# Altium schematic sheet SmartGarden_PCB.SchDoc
size A4; SheetNumber: 1; SheetTotal: 1
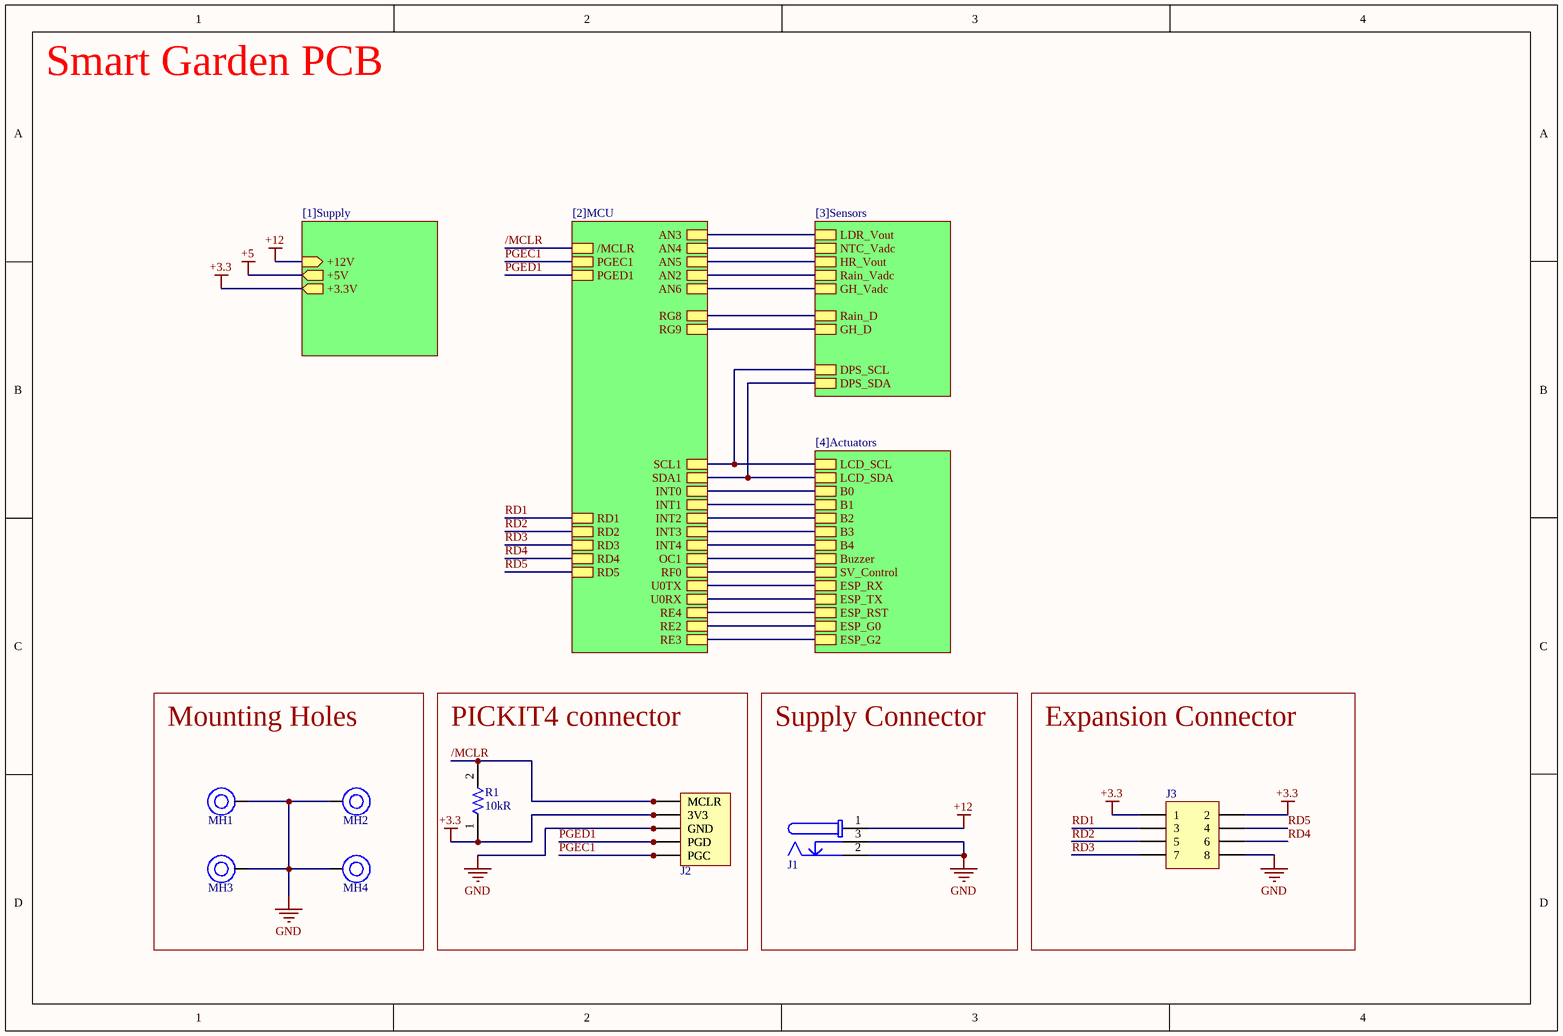
[diagram p0: SmartGarden_PCB.SchDoc]

## Parts
J1  694108301002  [694108301002]  (value not drawn)
J2  61300511121  [J_PinHeader_1x5]  (value not drawn)
J3  J_DualSocketHeader_8  [Dual socket header 8 pins]  (value not drawn)
MH1  Mounting_Hole_M3  [Mounting_Hole_M3]  (value not drawn)
MH2  Mounting_Hole_M3  [Mounting_Hole_M3]  (value not drawn)
MH3  Mounting_Hole_M3  [Mounting_Hole_M3]  (value not drawn)
MH4  Mounting_Hole_M3  [Mounting_Hole_M3]  (value not drawn)
R1  Resistance: 10kR  [R0805FTK]  (hidden comment: CR0805-JW-103ELF)

## Blocks framed on the sheet
Mounting Holes: MH1-MH4
PICKIT4 connector: J2 R1
Supply Connector: J1
Expansion Connector: J3

## Sub-sheets
[1]Supply = [1]Supply: +12V (in), +5V (out), +3.3V (out)
[2]MCU = [2]MCU: /MCLR, PGEC1, PGED1, SCL1, SDA1, OC1, RF0, INT0, INT3, INT4, INT2, INT1, AN3, AN4, AN5, AN2, AN6, U0RX, U0TX, RE2, RE3, RE4, RG8, RG9, RD2, RD3, RD4, RD5, RD1
[3]Sensors = [3]Sensors: LDR_Vout, DPS_SDA, DPS_SCL, NTC_Vadc, HR_Vout, Rain_Vadc, GH_Vadc, Rain_D, GH_D
[4]Actuators = [4]Actuators: LCD_SDA, LCD_SCL, Buzzer, SV_Control, B0, B1, B2, B3, B4, ESP_TX, ESP_G2, ESP_G0, ESP_RST, ESP_RX

## Nets
+3.3: J2.2(3V3) J3.1 J3.2 R1.1 ; sheet [1]Supply/+3.3V
+5: sheet [1]Supply/+5V
+12: J1.1 ; sheet [1]Supply/+12V
GND: J1.2 J1.3 J2.3(GND) J3.8 MH1.1 MH2.1 MH3.1 MH4.1
/MCLR: J2.1(MCLR) R1.2 ; sheet [2]MCU//MCLR
PGEC1: J2.5(PGC) ; sheet [2]MCU/PGEC1
PGED1: J2.4(PGD) ; sheet [2]MCU/PGED1
RD1: J3.3 ; sheet [2]MCU/RD1
RD2: J3.5 ; sheet [2]MCU/RD2
RD3: J3.7 ; sheet [2]MCU/RD3
RD4: J3.6 ; sheet [2]MCU/RD4
RD5: J3.4 ; sheet [2]MCU/RD5
(unnamed): sheet [2]MCU/SCL1, sheet [3]Sensors/DPS_SCL, sheet [4]Actuators/LCD_SCL
(unnamed): sheet [2]MCU/SDA1, sheet [3]Sensors/DPS_SDA, sheet [4]Actuators/LCD_SDA
(unnamed): sheet [2]MCU/OC1, sheet [4]Actuators/Buzzer
(unnamed): sheet [2]MCU/RF0, sheet [4]Actuators/SV_Control
(unnamed): sheet [2]MCU/INT0, sheet [4]Actuators/B0
(unnamed): sheet [2]MCU/INT3, sheet [4]Actuators/B3
(unnamed): sheet [2]MCU/INT4, sheet [4]Actuators/B4
(unnamed): sheet [2]MCU/INT2, sheet [4]Actuators/B2
(unnamed): sheet [2]MCU/INT1, sheet [4]Actuators/B1
(unnamed): sheet [2]MCU/AN3, sheet [3]Sensors/LDR_Vout
(unnamed): sheet [2]MCU/AN4, sheet [3]Sensors/NTC_Vadc
(unnamed): sheet [2]MCU/AN5, sheet [3]Sensors/HR_Vout
(unnamed): sheet [2]MCU/AN2, sheet [3]Sensors/Rain_Vadc
(unnamed): sheet [2]MCU/AN6, sheet [3]Sensors/GH_Vadc
(unnamed): sheet [2]MCU/U0RX, sheet [4]Actuators/ESP_TX
(unnamed): sheet [2]MCU/U0TX, sheet [4]Actuators/ESP_RX
(unnamed): sheet [2]MCU/RE2, sheet [4]Actuators/ESP_G0
(unnamed): sheet [2]MCU/RE3, sheet [4]Actuators/ESP_G2
(unnamed): sheet [2]MCU/RE4, sheet [4]Actuators/ESP_RST
(unnamed): sheet [2]MCU/RG8, sheet [3]Sensors/Rain_D
(unnamed): sheet [2]MCU/RG9, sheet [3]Sensors/GH_D

## Notes on the sheet
- Smart Garden PCB

## Library data of the parts
J1 = 694108301002: WR-DC DC Power Jack Connector, Male, Right Angled, 24V, 5A; Manufacturer: Wurth Elektronik; Opening Diameter: 6.4mm; Plug Inner Diameter: 2.55mm; Plug Outer Diameter: 5.5mm; ComponentLink1Description: Website Link; ComponentLink1URL: https://www.we-online.com/redexpert/article/694108301002?ad; ComponentLink2Description: Datasheet Link; ComponentLink2URL: https://www.we-online.com/redexpert/spec/694108301002?ad; Manufacturer Part Number: 694108301002; Category: DC Power Jack Connector; Match Code: WR-DC; Mount: Through Hole; Operating Temperature Max: 85°C; Operating Temperature Min: -40°C; Packaging: Bag; Gender: Male; Orientation: Right Angled; Rated Current: 5A; Working Voltage: 24V
J2 = J_Pickit3: THT Vertical Pin Header WR-PHD, Pitch 2.54 mm, Single Row, 5 pins; Manufacturer: Molex; Temperature rating: -40° to +105°C; Category type: PCB-PCB; Maximum current: 3 A; Maximum voltage: 250 V AC; Connections: 1x5; Number of Positions: 5; Gender: Male; Connector Type: Male Pin; Pitch: 0.1inch; .Creator: GP; Category: Connector; ComponentLink1Description: Datasheet; ComponentLink1URL: https://www.we-online.com/catalog/datasheet/61300511121.pdf; ComponentLink2Description: Where buy it; ComponentLink2URL: https://www.we-online.com/catalog/en/PHD_2_54_THT_PIN_HEADER_6130XX11121?sq=61300511121&sp=https%3A%2F%2Fwww.we-online.com%2Fweb%2Fen%2Fwuerth_elektronik%2Fsearchpage.php%3Fsearch%3D61300511121#61300511121; Manufacturer part number: 61300511121; Supplier: Würth Elektronik; RoHS: *; Application: Charge program; Product name: Pin Header; Flammability: 94V-0; Orientation: vertical; Mount: Through hole; Supplier 1: Mouser; Stock 1: 1878; Pricing 1: 1=0,26000, 10=0,21600, 25=0,18000, 50=0,15000, 100=0,13700, 1000=0,12400, 10000=0,12400 (USD); Contact Plating: Gold; Contact Material: Copper; Color: Black; Number of Rows: 1; Packaging: Bulk; Termination: Solder; Number of Contacts: 5; Contact Mating Length: 0.236inch; REACH SVHC: Unknown; Lead Free: Lead Free; ComponentLink3URL: http://www.farnell.com/cad/1737268.pdf?src-supplier=Element14; ComponentLink3Description: http://www.farnell.com/cad/1737268.pdf?src-supplier=Element14; ComponentLink4URL: https://katalog.we-online.de/em/datasheet/6130xx11121.pdf?src-supplier=Digi-Key; ComponentLink4Description: https://katalog.we-online.de/em/datasheet/6130xx11121.pdf?src-supplier=Digi-Key; Supplier Part Number 1: 710-61300511121
R1 = R10k-0805FTK: BOURNS         CR0805-JW-103ELF            Surface Mount Chip Resistor, Thick Film, CR Series, 10 kohm, 125 mW,  5%, 150 V; Temperature Coefficient: 200ppm/°C; Power Rating: 125mW; Voltage Rating: 150V; Voltage Rating (DC): 100V; .Creator: DR; Supplier 1: Arrow Electronics; Manufacturer 1: Bourns; Manufacturer Part Number 1: CR0805-JW-103ELF; RoHS: Yes; Category: Chip SMD Resistors; Stock 1: 57566; Pricing 1: 1=0,05790, 10=0,01540, 25=0,01340, 100=0,00340 (USD); Mount: Surface Mount; Case/Package: 0805; Number of Pins: 2; Contact Plating: Tin; Case Code (Metric): 2012; Case Code (Imperial): 0805; Min Operating Temperature: -55°C; Max Operating Temperature: 155°C; Tolerance: 5%; Resistor Type: Thick Film; Package Quantity: 1; Packaging: Tape and Reel; Number of Terminations: 2; Termination: SMD/SMT; Max Power Dissipation: 125mW; Features: Moisture Resistant; Series: CR0805; Construction: Rectangular; Resistance Tolerance: 5%; Technology: THICK FILM; Length: 2mm; Width: 1.25mm; Height: 0.5mm; Depth: 1.25mm; Thickness: 508um; Radiation Hardening: No; REACH SVHC: No SVHC; Military Standard: Not; RoHS Compliant: Yes; ComponentLink1URL: https://datasheet.ciiva.com/11821/0900766b80fcdb72-11821135.pdf?src-supplier=RSComponents; ComponentLink1Description: https://datasheet.ciiva.com/11821/0900766b80fcdb72-11821135.pdf?src-supplier=RSComponents; ComponentLink2URL: https://datasheet.ciiva.com/9122/chpreztr-9122374.pdf?src-supplier=Avnet; ComponentLink2Description: https://datasheet.ciiva.com/9122/chpreztr-9122374.pdf?src-supplier=Avnet; ComponentLink3URL: https://datasheet.ciiva.com/22693/1902866-22693254.pdf?src-supplier=Element14; ComponentLink3Description: https://datasheet.ciiva.com/22693/1902866-22693254.pdf?src-supplier=Element14; ComponentLink4URL: https://datasheet.ciiva.com/7986/691949-7986187.pdf?src-supplier=Element14; ComponentLink4Description: https://datasheet.ciiva.com/7986/691949-7986187.pdf?src-supplier=Element14; ComponentLink5URL: https://datasheet.ciiva.com/30065/159chpreztr-30065976.pdf?src-supplier=Onlinecomponents.com; ComponentLink5Description: https://datasheet.ciiva.com/30065/159chpreztr-30065976.pdf?src-supplier=Onlinecomponents.com; ComponentLink6URL: https://datasheet.ciiva.com/16783/70154685-16783482.pdf?src-supplier=Allied+Electronics; ComponentLink6Description: https://datasheet.ciiva.com/16783/70154685-16783482.pdf?src-supplier=Allied+Electronics; ComponentLink7URL: https://datasheet.ciiva.com/5548/chpreztr-5548491.pdf?src-supplier=Mouser; ComponentLink7Description: https://datasheet.ciiva.com/5548/chpreztr-5548491.pdf?src-supplier=Mouser; ComponentLink8URL: https://datasheet.ciiva.com/6559/chpreztr-6559900.pdf?src-supplier=Digi-Key; ComponentLink8Description: https://datasheet.ciiva.com/6559/chpreztr-6559900.pdf?src-supplier=Digi-Key; ComponentLink9URL: https://datasheet.ciiva.com/6559/chpreztr-6559901.pdf?src-supplier=Digi-Key; ComponentLink9Description: https://datasheet.ciiva.com/6559/chpreztr-6559901.pdf?src-supplier=Digi-Key; ComponentLink10URL: https://datasheet.ciiva.com/7985/1856384-7985869.pdf?src-supplier=Element14; ComponentLink10Description: https://datasheet.ciiva.com/7985/1856384-7985869.pdf?src-supplier=Element14; ComponentLink11URL: https://datasheet.ciiva.com/48692/001055517-da-01-en-smd-wid-cr0805-jw-103elf-10k-ohm-1-8w-48692118.pdf?src-supplier=Conrad; ComponentLink11Description: https://datasheet.ciiva.com/48692/001055517-da-01-en-smd-wid-cr0805-jw-103elf-10k-ohm-1-8w-48692118.pdf?src-supplier=Conrad; Supplier Part Number 1: CR0805-JW-103ELF